# EAGLE schematic fadic (EAGLE 7.7.0)
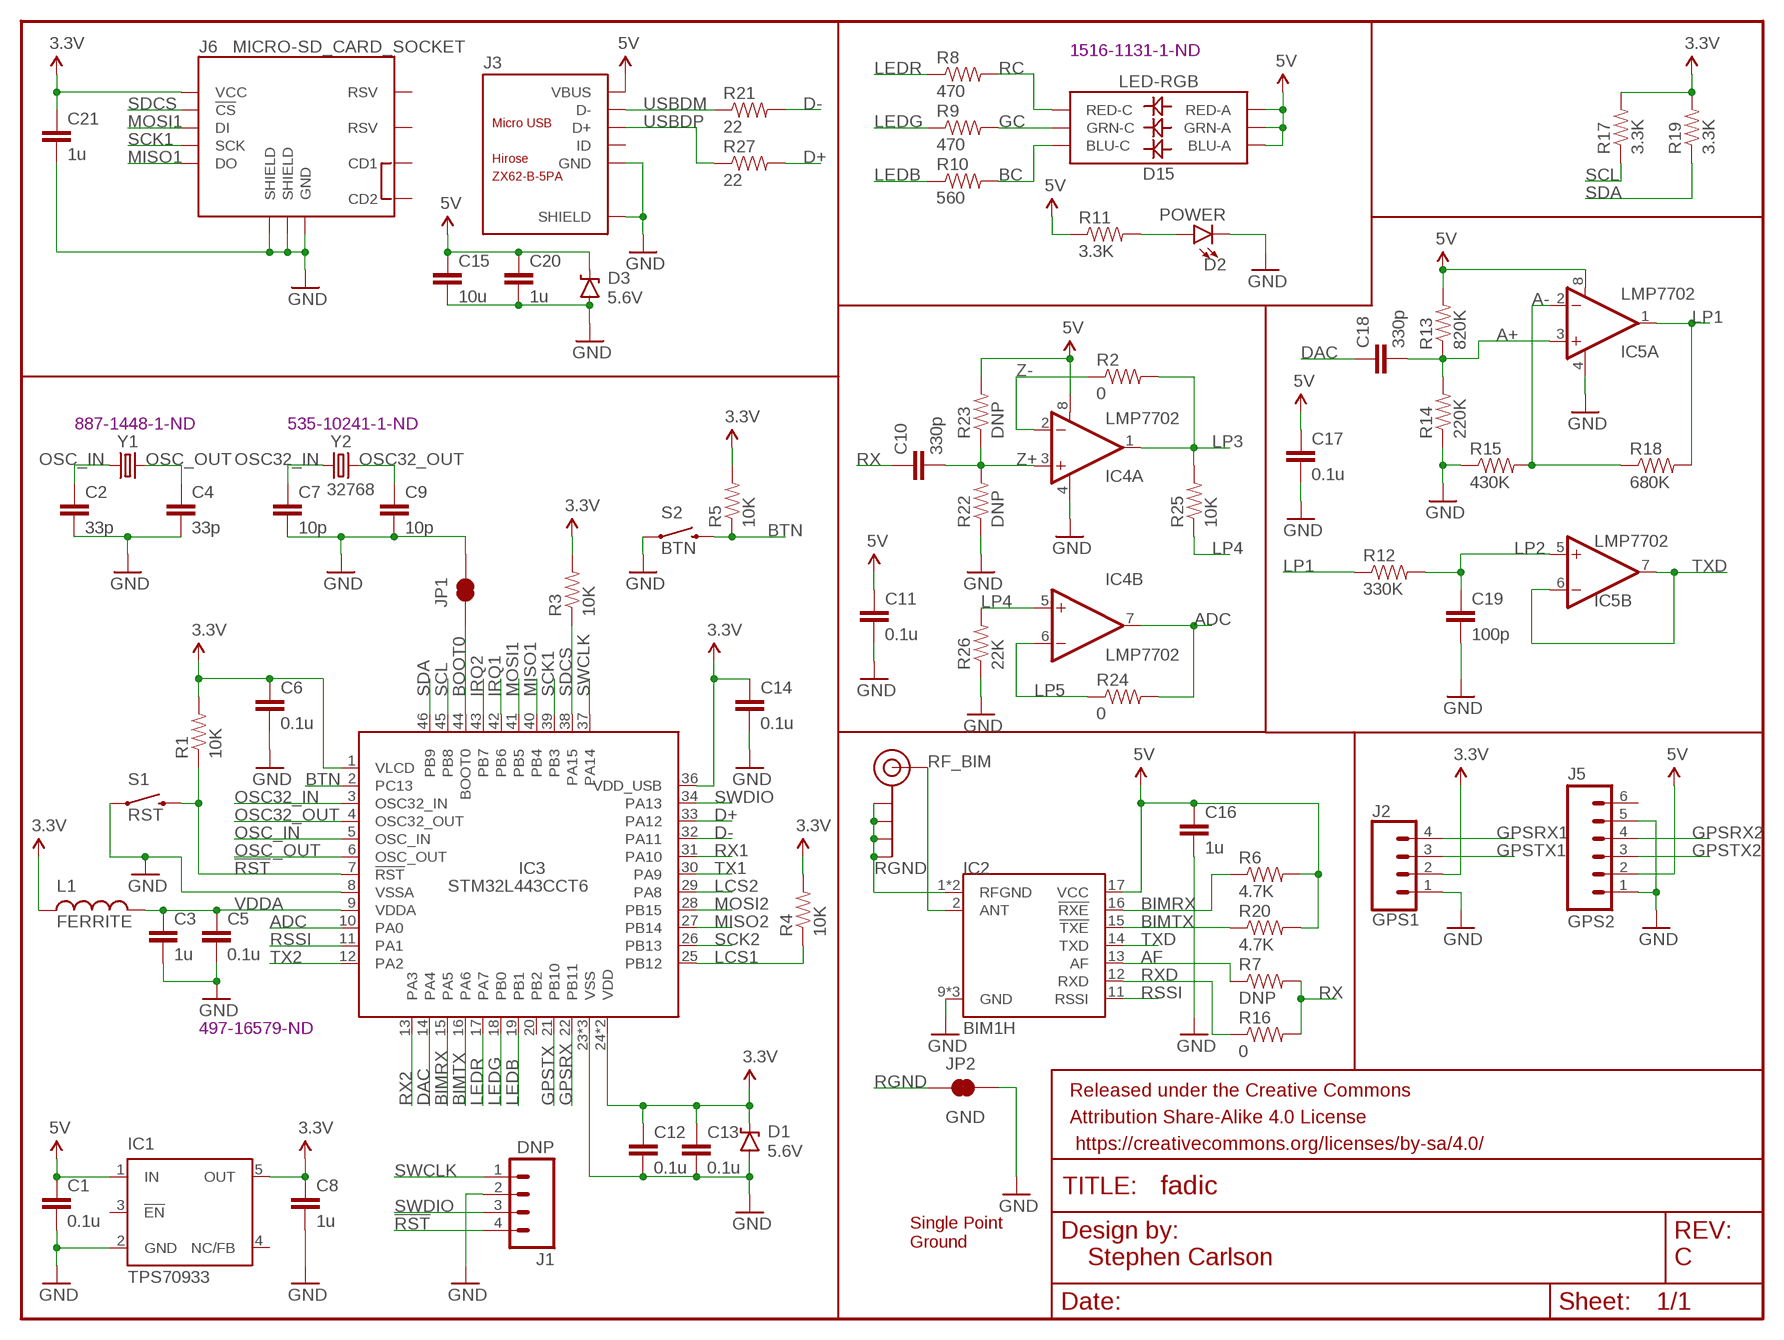
[diagram p0: schematic, sheet 1]

## Parts
C1  0.1u  CAP0805  [0805]
C2  33p  CAP0805  [0805]
C3  1u  CAP0805  [0805]
C4  33p  CAP0805  [0805]
C5  0.1u  CAP0805  [0805]
C6  0.1u  CAP0805  [0805]
C7  10p  CAP0805  [0805]
C8  1u  CAP0805  [0805]
C9  10p  CAP0805  [0805]
C10  330p  CAP0805  [0805]
C11  0.1u  CAP0805  [0805]
C12  0.1u  CAP0805  [0805]
C13  0.1u  CAP0805  [0805]
C14  0.1u  CAP0805  [0805]
C15  10u  CAP0805  [0805]
C16  1u  CAP0805  [0805]
C17  0.1u  CAP0805  [0805]
C18  330p  CAP0805  [0805]
C19  100p  CAP0805  [0805]
C20  1u  CAP0805  [0805]
C21  1u  CAP0805  [0805]
D1  5.6V  DIODE-ZENER5.6V  [SOD-323]
D2  POWER  LED-GREEN0603  [LED-0603]
D3  5.6V  DIODE-ZENER5.6V  [SOD-323]
D15  LED-RGB  [LED-TRICOLOR-5050]
FRAME1  FRAME-LETTERNO_PACKAGE  [DUMMY]
IC1  TPS70933  TPS77033  [SOT23-DBV]
IC2  BIM1H  [BIM1H]
IC3  STM32L443CCT6  STM32L07C  [TQFP48]
IC4  LMP7702  LMP7702VSSOP  [VSSOP8]
IC5  LMP7702  LMP7702VSSOP  [VSSOP8]
J1  DNP  M04LOCK  [1X04_LOCK@1]
J2  GPS1  CONN_04JST-PTH  [JST-4-PTH]
J3  ZX62-B-5PA  MICRO-USB-SMD(ZX62-B-5PA)  [MICRO-USB5+6P-SMD-0.65-AB]
J5  GPS2  M06SMD-1MM  [1X06-1MM]
J6  MICRO-SD_CARD_SOCKET  [MICRO-SD-SOCKET]
J$1  SMA_EDGE  [SMA-EDGE]
JP1  JUMPER-SMT_2_NC_TRACE_NO-SILK  [SMT-JUMPER_2_NC_TRACE_NO-SILK]
JP2  GND  JUMPER-PAD-2-NC_BY_TRACE  [PAD-JUMPER-2-NC_BY_TRACE_YES_SILK]
L1  FERRITE  INDUCTOR0805  [0805]
R1  10K  RESISTOR0805-RES  [0805]
R2  0  RESISTOR0805-RES  [0805]
R3  10K  RESISTOR0805-RES  [0805]
R4  10K  RESISTOR0805-RES  [0805]
R5  10K  RESISTOR0805-RES  [0805]
R6  4.7K  RESISTOR0805-RES  [0805]
R7  DNP  RESISTOR0805-RES  [0805]
R8  470  RESISTOR0805-RES  [0805]
R9  470  RESISTOR0805-RES  [0805]
R10  560  RESISTOR0805-RES  [0805]
R11  3.3K  RESISTOR0805-RES  [0805]
R12  330K  RESISTOR0805-RES  [0805]
R13  820K  RESISTOR0805-RES  [0805]
R14  220K  RESISTOR0805-RES  [0805]
R15  430K  RESISTOR0805-RES  [0805]
R16  0  RESISTOR0805-RES  [0805]
R17  3.3K  RESISTOR0805-RES  [0805]
R18  680K  RESISTOR0805-RES  [0805]
R19  3.3K  RESISTOR0805-RES  [0805]
R20  4.7K  RESISTOR0805-RES  [0805]
R21  22  RESISTOR0805-RES  [0805]
R22  DNP  RESISTOR0805-RES  [0805]
R23  DNP  RESISTOR0805-RES  [0805]
R24  0  RESISTOR0805-RES  [0805]
R25  10K  RESISTOR0805-RES  [0805]
R26  22K  RESISTOR0805-RES  [0805]
R27  22  RESISTOR0805-RES  [0805]
S1  RST  SWITCH  [TACTILE-PTH-THIN]
S2  BTN  SWITCH  [TACTILE-PTH-THIN]
Y1  8M  CRYSTALTXC-7A  [CRYSTAL-TXC-7A]
Y2  32768  CRYSTAL  [ABS25]

## Nets
3.3V: C6.1 C8.1 C12.1 C13.1 C14.1 C21.1 D1.C IC1.5(OUT) IC3.1(VLCD) IC3.24(VDD) IC3.36(VDD_USB) IC3.48(VDD) J2.2 J6.VCC L1.1 R1.2 R3.2 R4.2 R5.2 R17.2 R19.2
5V: C1.1 C11.1 C15.1 C16.1 C17.1 C20.1 D3.C D15.4(RED-A) D15.5(GRN-A) D15.6(BLU-A) IC1.1(IN) IC2.17(VCC) IC4.8(A:V+) IC5.8(A:V+) J3.1(VBUS) J5.2 R6.2 R11.1 R13.2 R20.2 R23.2
!RST!: IC3.7(!RST!) J1.4 R1.1 S1.2
A+: C18.2 IC5.3(A:+IN) R13.1 R14.2
A-: IC5.2(A:-IN) R15.2 R18.1
ADC: IC3.10(PA0) IC4.7(B:OUT) R24.2
AF: IC2.13(AF) R7.1
BC: D15.1(BLU-C) R10.2
BIMRX: IC2.16(!RXE!) IC3.15(PA5) R6.1
BIMTX: IC2.15(!TXE!) IC3.16(PA6) R20.1
BOOT0: IC3.44(BOOT0) JP1.1
BTN: IC3.2(PC13) R5.1 S2.2
D+: IC3.33(PA12) R27.2
D-: IC3.32(PA11) R21.2
DAC: C18.1 IC3.14(PA4)
GC: D15.2(GRN-C) R9.2
GND: C1.2 C2.2 C3.2 C4.2 C5.2 C6.2 C7.2 C8.2 C9.2 C11.2 C12.2 C13.2 C14.2 C15.2 C16.2 C17.2 C19.2 C20.2 C21.2 D1.A D2.C D3.A IC1.2(GND) IC2.9(GND) IC2.10(GND) IC2.18(GND) IC3.8(VSSA) IC3.23(VSS) IC3.35(VSS) IC3.47(VSS) IC4.4(A:V-) IC5.4(A:V-) J1.2 J2.1 J3.5(GND) J3.P1(SHIELD) J3.P2(SHIELD) J3.P3(SHIELD) J3.P4(SHIELD) J3.P5(SHIELD) J3.P6(SHIELD) J5.1 J5.5 J6.GND J6.GND1(SHIELD) J6.GND3(SHIELD) JP1.2 JP2.2 R14.1 R15.1 R22.1 R26.1 S1.1 S2.1
GPSRX: IC3.22(PB11)
GPSRX1: J2.4
GPSRX2: J5.4
GPSTX: IC3.21(PB10)
GPSTX1: J2.3
GPSTX2: J5.3
IRQ1: IC3.42(PB6)
IRQ2: IC3.43(PB7)
LCS1: IC3.25(PB12) R4.1
LCS2: IC3.29(PA8)
LEDB: IC3.19(PB1) R10.1
LEDG: IC3.18(PB0) R9.1
LEDR: IC3.17(PA7) R8.1
LP1: IC5.1(A:OUT) R12.1 R18.2
LP2: C19.1 IC5.5(B:+IN) R12.2
LP3: IC4.1(A:OUT) R2.2 R25.2
LP4: IC4.5(B:+IN) R25.1 R26.2
LP5: IC4.6(B:-IN) R24.1
MISO1: IC3.40(PB4) J6.DO
MISO2: IC3.27(PB14)
MOSI1: IC3.41(PB5) J6.DI
MOSI2: IC3.28(PB15)
OSC32_IN: C7.1 IC3.3(OSC32_IN) Y2.1
OSC32_OUT: C9.1 IC3.4(OSC32_OUT) Y2.4
OSC_IN: C2.1 IC3.5(OSC_IN) Y1.P$1
OSC_OUT: C4.1 IC3.6(OSC_OUT) Y1.P$2
PLED: D2.A R11.2
RC: D15.3(RED-C) R8.2
RF_BIM: IC2.2(ANT) J$1.SIG(SIGNAL)
RGND: IC2.1(RFGND) IC2.3(RFGND) J$1.GND@0(GND) J$1.GND@1(GND) J$1.GND@2(GND) J$1.GND@3(GND) JP2.1
RSSI: IC2.11(RSSI) IC3.11(PA1)
RX: C10.1 R7.2 R16.2
RX1: IC3.31(PA10)
RX2: IC3.13(PA3)
RXD: IC2.12(RXD) R16.1
SCK1: IC3.39(PB3) J6.SCLK(SCK)
SCK2: IC3.26(PB13)
SCL: IC3.45(PB8) R17.1
SDA: IC3.46(PB9) R19.1
SDCS: IC3.38(PA15) J6.CS(!CS) R3.1
SWCLK: IC3.37(PA14) J1.1
SWDIO: IC3.34(PA13) J1.3
TX1: IC3.30(PA9)
TX2: IC3.12(PA2)
TXD: IC2.14(TXD) IC5.6(B:-IN) IC5.7(B:OUT)
USBDM: J3.2(D-) R21.1
USBDP: J3.3(D+) R27.1
VDDA: C3.1 C5.1 IC3.9(VDDA) L1.2
Z+: C10.2 IC4.3(A:+IN) R22.2 R23.1
Z-: IC4.2(A:-IN) R2.1
Unconnected: IC1.3(!EN) IC1.4(NC/FB) IC3.20(PB2) J3.4(ID) J5.6 J6.CD1 J6.CD2 J6.RSV1(RSV) J6.RSV2(RSV)

## Notes on the sheet
- 1516-1131-1-ND
- 887-1448-1-ND | 535-10241-1-ND
- 497-16579-ND
- Single Point
  Ground
- Stephen Carlson | C

## Library data of the parts
C1-C21 = SparkFun-Passives:CAP: Capacitor Standard 0603 ceramic capacitor, and 0.1" leaded capacitor.
D1 D3 = SparkFun-DiscreteSemi:DIODE-ZENER: Zener Diode Production Part - 8199 3.4V Zener Voltage; PROD_ID: DIO-12442
D2 = SparkFun-LED:LED-GREEN: Green SMD LED Used in manufacturing of various products at SparkFun Packages: 0603 - SMD 0603 package [Product Link] <http://www.futureelectronics.com/en/technologies/semiconductors/optoelectronics/leds/Pages/9894312-LTST-C190GKT.aspx?CrossPart=HSMG-C190&IM=0> LilyPad 1206 - SMD1206 LilyPad package [Product Link] <http://www.futureelectronics.com/en/Technologies/Product.aspx?ProductID=IN150NGHARVATEKCORPORATION2049943&IM=0> 1206 - SMD1206 package [Product Link] <http://www.futureelectronics.com/en/technologies/semiconductors/optoelectronics/leds/Pages/8315665-LTST-C150KGKT.aspx?IM=0> 1206 Bottom Mount -SMD 1206 Bottom Mount [Product Link] <http://www.digikey.com/product-detail/en/lite-on-inc/LTST-C230KGKT/160-1456-1-ND/386854> SparkFun Products: Pro Mini 328 -5V <https://www.sparkfun.com/products/821> RedBoard <https://www.sparkfun.com/products/12757> MP3 Trigger <https://www.sparkfun.com/products/13720> Makey Makey <https://www.sparkfun.com/products/11076>; PROD_ID: DIO-00821; VALUE: GREEN
D15 = HAB:LED-RGB: RGB LED Digi-Key Part Number1516-1131-2-ND (QT Brightek QBLP679E-RGB)
FRAME1 = SparkFun-Aesthetics:FRAME-LETTER: Schematic Frame - Letter Standard 8.5x11 US Letter frame; DESIGNER: Nobody; VERSION: v01
IC1 = texas:TPS770*: ULTRALOW-POWER 50-mA LOW-DROPOUT LINEAR REGULATORS 50-mA Low-Dropout Regulator Source: http://focus.ti.com/lit/ds/symlink/tps77001.pdf; MF: TEXAS INSTRUMENTS; MPN: TPS77033DBVT; OC_FARNELL: 8461570; OC_NEWARK: 77C1187
IC2 = HAB:BIM1H: BiM1H VHF Narrow Band FM 500mW transceiver
IC3 = stm32xx:STM32L07*C: STM32L07XC STM32L07X series in LQFP-48 package
IC4 IC5 = HAB:LMP7702: LMP7702 Precision, CMOS Input, RRIO, Wide Supply Range Amplifiers
J1 = SparkFun-Connectors:M04: Header 4 Standard 4-pin 0.1" header. Use with straight break away headers (SKU : PRT-00116), right angle break away headers (PRT-00553), swiss pins (PRT-00743), machine pins (PRT-00117), and female headers (PRT-00115). Molex polarized connector foot print use with SKU : PRT-08231 with associated crimp pins and housings. 1MM SMD Version SKU: PRT-10208; PROD_ID: CONN-09696
J2 = SparkFun-Connectors:CONN_04: Multi connection point. Often used as Generic Header-pin footprint for 0.1 inch spaced/style header connections On any of the 0.1 inch spaced packages, you can populate with these: Break Away Headers - Straight <https://www.sparkfun.com/products/116> (PRT-00116) Break Away Male Headers - Right Angle <https://www.sparkfun.com/products/553> (PRT-00553) Female Headers <https://www.sparkfun.com/products/115> (PRT-00115) Break Away Headers - Machine Pin <https://www.sparkfun.com/products/117> (PRT-00117) Break Away Female Headers - Swiss Machine Pin <https://www.sparkfun.com/products/743> (PRT-00743) For SCREWTERMINALS and SPRING TERMINALS visit here: Screw Terimnals on SparkFun.com <https://www.sparkfun.com/search/results?term=Screw+Terminals> (5mm/3.5mm/2.54mm spacing) This device is also useful as a general connection point to wire up your design to another part of your project. Our various solder wires solder well into these plated through hole pads. Hook-Up Wire - Assortment (Stranded, 22 AWG) <https://www.sparkfun.com/products/11375> (PRT-11375) Hook-Up Wire - Assortment (Solid Core, 22 AWG) <https://www.sparkfun.com/products/11367> (PRT-11367) View the entire wire category on our website here <https://www.sparkfun.com/categories/141> Special notes: Molex polarized connector foot print use with SKU : PRT-08231 with associated crimp pins and housings. 1MM SMD Version SKU: PRT-10208; PROD_ID: WIRE-13531; SF_ID: PRT-09916
J3 = OPL_Connector:MICRO-USB-SMD(ZX62-B-5PA): 320010005; MPN: ZX62-B-5PA
J5 = SparkFun-Connectors:M06: Header 6 Standard 6-pin 0.1" header. Use with straight break away headers (SKU : PRT-00116), right angle break away headers (PRT-00553), swiss pins (PRT-00743), machine pins (PRT-00117), and female headers (PRT-00115). Molex polarized connector foot print use with SKU : PRT-08094 with associated crimp pins and housings. NOTES ON THE VARIANTS LOCK and LOCK_LONGPADS... This footprint was designed to help hold the alignment of a through-hole component (i.e. 6-pin header) while soldering it into place. You may notice that each hole has been shifted either up or down by 0.005 of an inch from it's more standard position (which is a perfectly straight line). This slight alteration caused the pins (the squares in the middle) to touch the edges of the holes. Because they are alternating, it causes a "brace" to hold the component in place. 0.005 has proven to be the perfect amount of "off-center" position when using our standard breakaway headers. Although looks a little odd when you look at the bare footprint, once you have a header in there, the alteration is very hard to notice. Also,if you push a header all the way into place, it is covered up entirely on the bottom side. This idea of altering the position of holes to aid alignment will be further integrated into the Sparkfun Library for other footprints. It can help hold any component with 3 or more connection pins.
J6 = SparkFun-Connectors:MICRO-SD_CARD_SOCKET: microSD Socket for Transflash Push-push type µSD socket. tDoc lines correctly indicate media card edge positions when inserting (unlocked, locked, depressed). NOTE: CD1 and CD2 are connected internally, and the default detect state of the socket is detect pin to ground. SparkFun Products: WAV Trigger <https://www.sparkfun.com/products/13660> CAN-Bus Shield <https://www.sparkfun.com/products/13262> SparkFun Level Shifing microSD Breakout <https://www.sparkfun.com/products/13743>; PROD_ID: CONN-07820; SF_ID: PRT-00127
J$1 = SparkFun-Connectors:SMA_EDGE: SMA Antenna Connector End launch SMA connector. The paste layer has been removed so that the connector can be hand soldered onto the board after reflow.
JP1 = SparkFun-Jumpers:JUMPER-SMT_2_NC_TRACE: Normally closed trace jumper This jumper has a trace between two pads so it's normally closed (NC). Use a razor knife to open the connection. For best results follow the IPC guidelines for cutting traces: Cutout at least 0.063 mm (0.005 in). Remove all loose material to clean up the cut area. Seal the cut with an approved epoxy. Reapply solder to reclose the connection.
JP2 = SparkFun-Passives:JUMPER-PAD-2-NC_BY_TRACE
L1 = HAB:INDUCTOR: INDUCTOR Standard inductor, with some new packages Why do inductors never come in standard packages!?
R1-R27 = SparkFun-Passives:RESISTOR: Resistor Basic schematic elements and footprints for 0603, 1206, and PTH resistors.
S1 S2 = HAB:SWITCH: SWITCH Package for the MJTP1250, a thinner and lighter PTH push button switch.
Y1 = SparkFun-FreqCtrl:CRYSTAL: Various standard crystals. Proven footprints.
Y2 = HAB:CRYSTAL: CRYSTAL Crystal oscillators in packages not in SparkFun-FreqCtl